# Altium schematic sheet SCHEMATIC_BUCK_OFFICIAL.SchDoc
size B; Organization: Altium Limited; Address1: L3, 12a Rodborough Rd; Address2: Frenchs Forest; Address3: NSW; Address4: Australia 2086
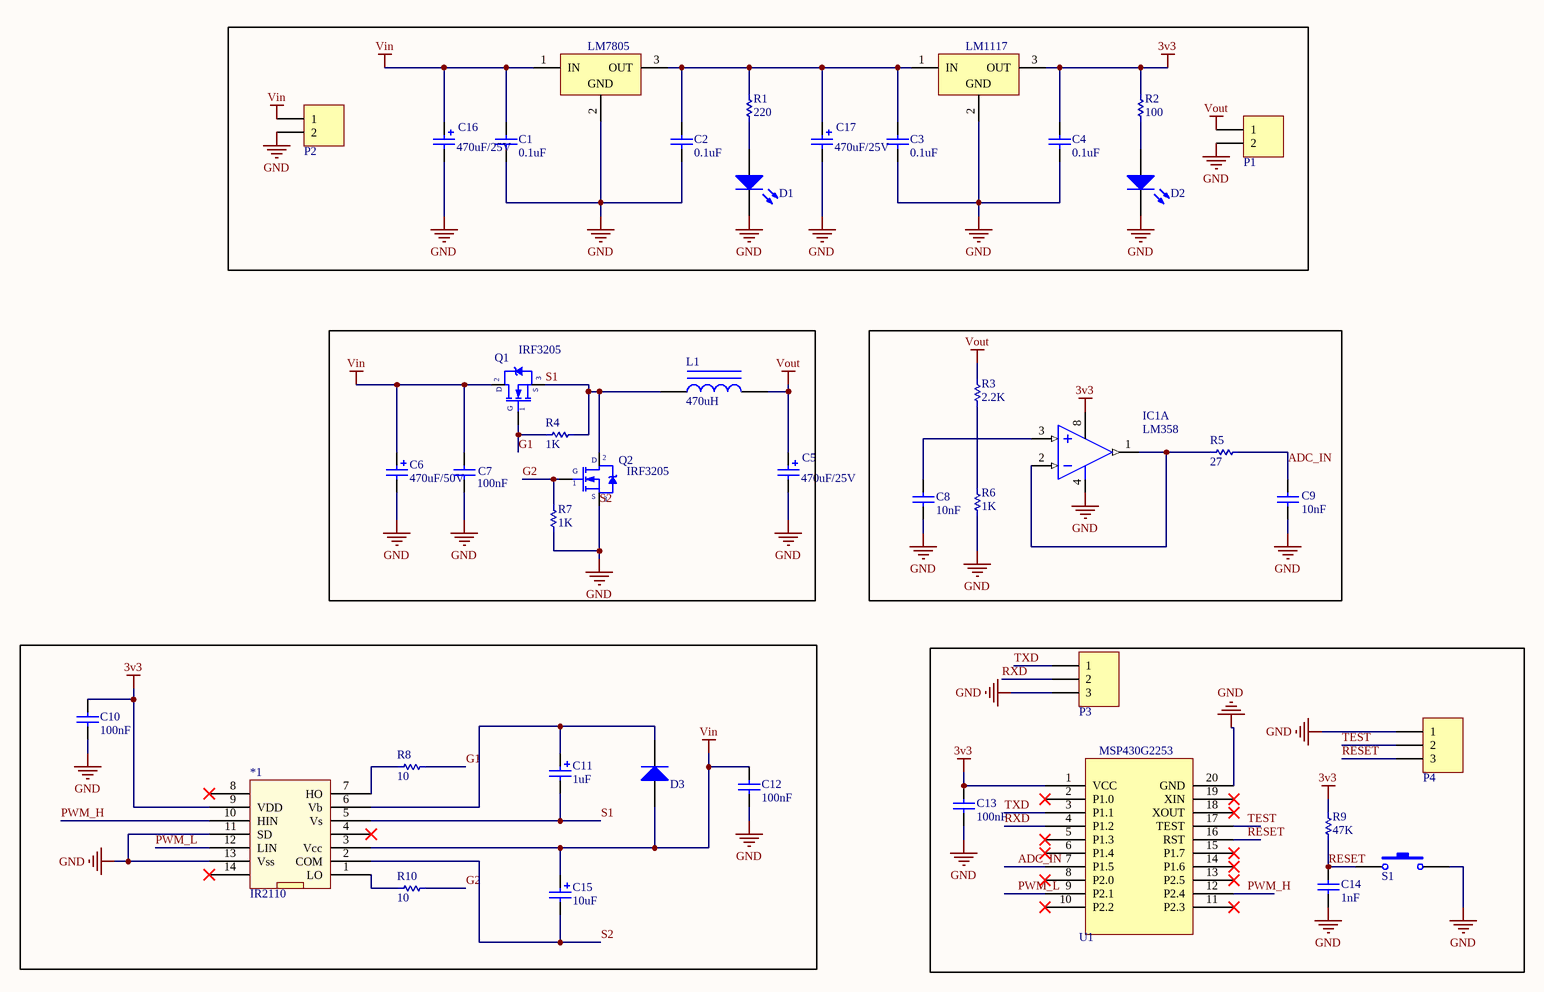
[diagram p0: SCHEMATIC_BUCK_OFFICIAL.SchDoc]

## Parts
*1  IR2110  [IR_2110_2]
C1  value 0.1uF  [CN1]  (hidden comment: Cap Non-Pol)
C2  value 0.1uF  [CN1]  (hidden comment: Cap Non-Pol)
C3  value 0.1uF  [CN1]  (hidden comment: Cap Non-Pol)
C4  value 0.1uF  [CN1]  (hidden comment: Cap Non-Pol)
C5  value 470uF/25V  [CP1/2]  (hidden comment: Cap Pol)
C6  value 470uF/50V  [CP1.5/3.4]  (hidden comment: Cap Pol)
C7  value 100nF  [CN1]  (hidden comment: Cap Non-Pol)
C8  value 10nF  [CN1]  (hidden comment: Cap Non-Pol)
C9  value 10nF  [CN1]  (hidden comment: Cap Non-Pol)
C10  value 100nF  [CN1]  (hidden comment: Cap Non-Pol)
C11  value 1uF  [CP1/2]  (hidden comment: Cap Pol)
C12  value 100nF  [CN1]  (hidden comment: Cap Non-Pol)
C13  value 100nF  [CN1]  (hidden comment: Cap Non-Pol)
C14  value 1nF  [CN1]  (hidden comment: Cap Non-Pol)
C15  value 10uF  [CP1/2]  (hidden comment: Cap Pol)
C16  value 470uF/25V  [CP1/2]  (hidden comment: Cap Pol)
C17  value 470uF/25V  [CP1/2]  (hidden comment: Cap Pol)
D1  LED  [LED-3mm]  (value not drawn)
D2  LED  [LED-3mm]  (value not drawn)
D3  Diode  [D1A]  (value not drawn)
IC1  LM358  [DIP8/W0.3]  (part A of 2)
L1  value 470uH  [R1/2W]  (hidden comment: Inductor Iron)
LM1117  LM7805  [QTO-220]  (value not drawn)
LM7805  LM7805  [QTO-220]  (value not drawn)
P1  Domino 2  [DOMINO 2- 5mm]  (value not drawn)
P2  Domino 2  [DOMINO 2- 5mm]  (value not drawn)
P3  Header 3  [JP3]  (value not drawn)
P4  Header 3  [JP3]  (value not drawn)
Q1  IRF3205  [QTO-220]
Q2  IRF3205  [QTO-220]
R1  value 220  [RES-SM-0805]  (hidden comment: Resistor 1/4W)
R2  value 100  [RES-SM-0805]  (hidden comment: Resistor 1/4W)
R3  value 2.2K  [RES-SM-0805]  (hidden comment: Resistor 1/4W)
R4  value 1K  [RES-SM-0805]  (hidden comment: Resistor 1/4W)
R5  value 27  [RES-SM-0805]  (hidden comment: Resistor 1/4W)
R6  value 1K  [RES-SM-0805]  (hidden comment: Resistor 1/4W)
R7  value 1K  [RES-SM-0805]  (hidden comment: Resistor 1/4W)
R8  value 10  [RES-SM-0805]  (hidden comment: Resistor 1/4W)
R9  value 47K  [RES-SM-0805]  (hidden comment: Resistor 1/4W)
R10  value 10  [RES-SM-0805]  (hidden comment: Resistor 1/4W)
S1  Tact SW - 2Pin  [SW2]  (value not drawn)
U1  MSP430G2553  [DIP20/W0.3]  (value not drawn)

## Nets
3v3: *1.9(VDD) C4.2 C10.2 C13.2 IC1.8(+V) LM1117.3(OUT) R2.2 R9.2 U1.1(VCC)
S2: *1.2(COM) *1.11(SD) *1.13(Vss) C1.1 C2.1 C3.1 C4.1 C5.2 C6.2 C7.1 C8.1 C9.2 C10.1 C12.1 C13.1 C14.1 C15.2 C16.2 C17.2 D1.2(K) D2.2(K) IC1.4(-V) LM1117.2(GND) LM7805.2(GND) P1.2 P2.2 P3.3 P4.1 Q2.3(S) R6.1 R7.1 S1.2 U1.20(GND)  [also labelled GND]
Vin: *1.3(Vcc) C1.2 C6.1 C7.2 C12.2 C15.1 C16.1 D3.1(A) LM7805.1(IN) P2.1 Q1.2(D)
Vout: C5.1 L1.2 P1.1 R3.2
ADC_IN: C9.1 R5.2 U1.7(P1.5)
G1: Q1.1(G) R4.1 R8.1
G2: Q2.1(G) R7.2 R10.1
PWM_H: *1.10(HIN) U1.12(P2.4)
PWM_L: *1.12(LIN) U1.9(P2.1)
RESET: C14.2 P4.3 R9.1 S1.1 U1.16(RST)
RXD: P3.2 U1.4(P1.2)
S1: *1.5(Vs) C11.2 L1.1 Q1.3(S) Q2.2(D) R4.2
TEST: P4.2 U1.17(TEST)
TXD: P3.1 U1.3(P1.1)
Net*1_1: *1.1(LO) R10.2
Net*1_6: *1.6(Vb) C11.1 D3.2(K)
Net*1_7: *1.7(HO) R8.2
NetC2_2: C2.2 C3.2 C17.1 LM1117.1(IN) LM7805.3(OUT) R1.2
NetC8_2: C8.2 IC1.3(IN+)
NetD1_1: D1.1(A) R1.1
NetD2_1: D2.1(A) R2.1
NetIC1_1: IC1.1(OUT) IC1.2(IN-) R5.1
NetR3_1: R3.1 R6.2

Not connected (* = marked no-connect by the designer): *1 4* 8* 14*; U1 2(P1.0)* 5(P1.3)* 6(P1.4)* 8(P2.0)* 10(P2.2)* 11(P2.3)* 13(P2.5)* 14(P1.6)* 15(P1.7)* 18(XOUT)* 19(XIN)*

## Notes on the sheet
- Title
- Size:
- Date:
- B
- Number:
- Time:
- Revision:
- Sheet
- of
- File:
- (in symbol MSP430G2553) MSP430G2253

## Library data of the parts
C1-C4 C7-C10 C12-C14 = Cap Non-Pol: Capacitor
C5 C6 C11 C15-C17 = Cap Pol: Polarized Capacitor (Radial)
D3 = Diode: Default Diode
IC1 = LM358: Low-Power Dual Operational Amplifier; Value: LM358
L1 = Inductor Iron: Magnetic-Core Inductor; Manufacturer: Generic Components; Class: Passive; Published: 1999; SubClass: Inductor
LM1117 LM7805 = LM7805: Positive Voltage Regulator
P1 P2 = Domino 2: Domino, 2-Pin; LatestRevisionDate: 17-Jul-2002; LatestRevisionNote: Re-released for DXP Platform.; Publisher: Altium Limited
P3 P4 = Header 3: Header, 3-Pin; LatestRevisionDate: 17-Jul-2002; LatestRevisionNote: Re-released for DXP Platform.; Publisher: Altium Limited
Q1 Q2 = IRF840: MOSFET N - CHANNEL 500V - 0.75 - 8A - TO-220; Value: IRF840
R1-R10 = RES
S1 = Tact SW - 2Pin: Switch button 2 pin